# Altium schematic sheet Sheet1.SchDoc
size A3
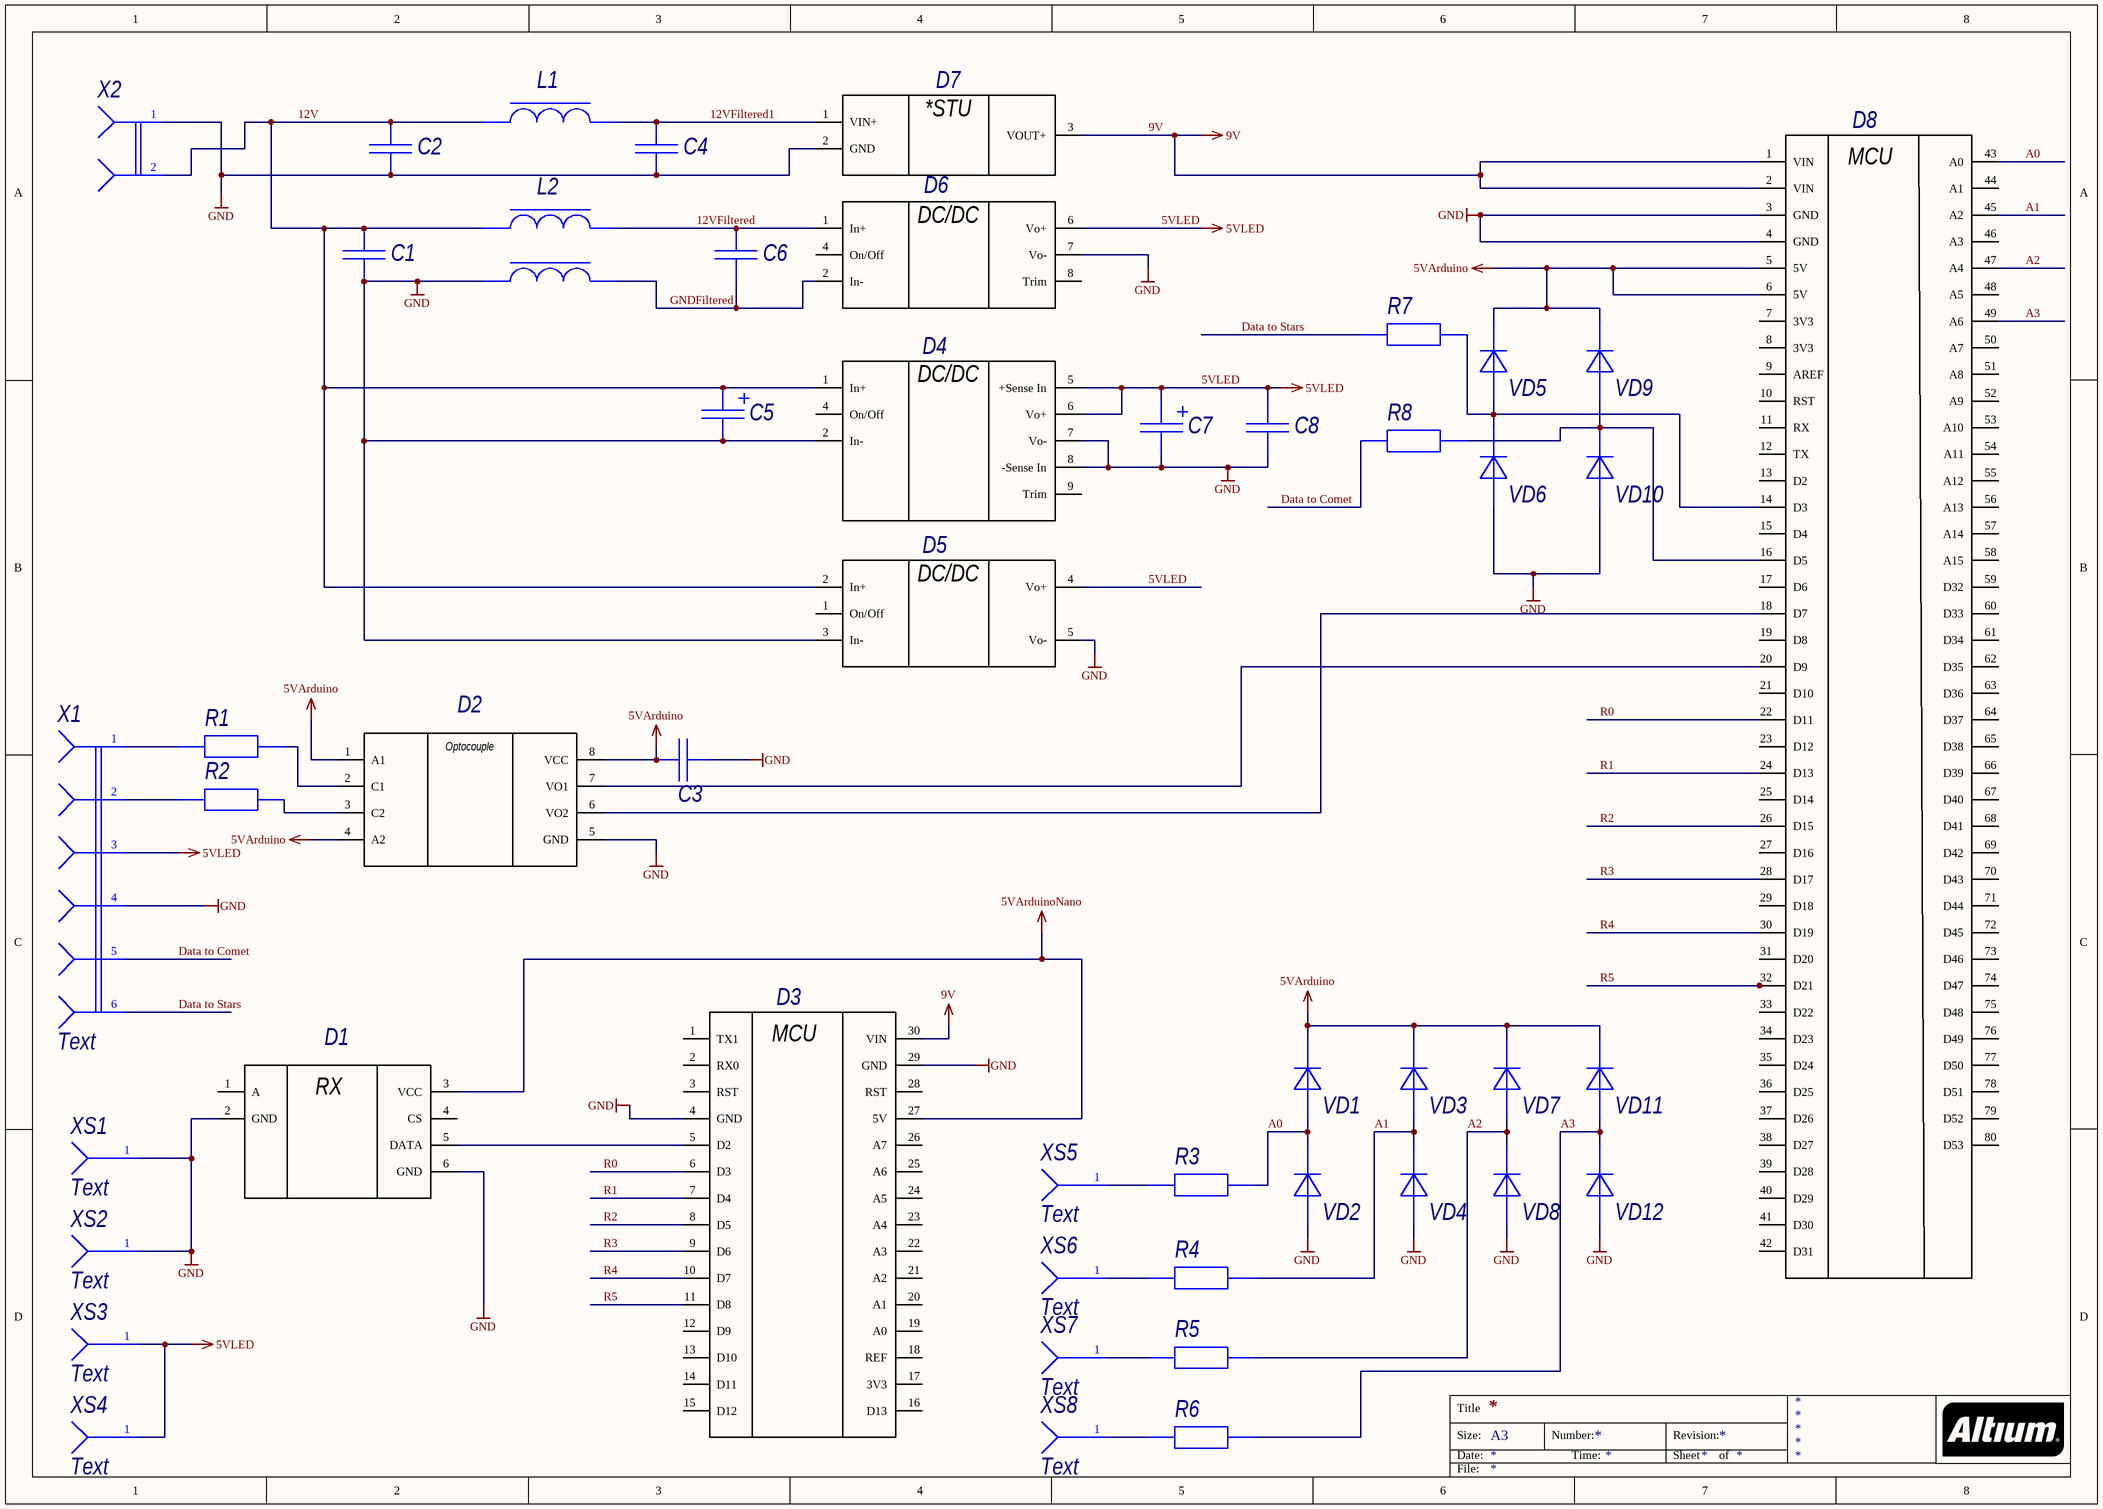
[diagram p0: Sheet1.SchDoc]

## Parts
C1  Capacitor  [0805CAP]  (value not drawn)
C2  Capacitor  [0805CAP]  (value not drawn)
C3  Capacitor  [0805CAP]  (value not drawn)
C4  Capacitor  [0805CAP]  (value not drawn)
C5  Capacitor-Polar  [AL_CAP_D6.3L7.7]  (value not drawn)
C6  Capacitor  [0805CAP]  (value not drawn)
C7  Capacitor-Polar  [AL_CAP_d4l5.4]  (value not drawn)
C8  Capacitor  [0805CAP]  (value not drawn)
D1  SRX882  [SRX882]  (value not drawn)
D2  HCPL-0631  [SOIC8]  (value not drawn)
D3  Arduino Nano  [ARDUINO_NANO]  (value not drawn)
D4  UEI-5-10-Q12PR-C  [UEI50 Case C74]  (value not drawn)
D5  МПА15  [МПА15]  (value not drawn)
D6  FDD25-05S1  [FDD25 50.8x50.8]  (value not drawn)
D7  R-78E9.0-0.5  [UL94V-0]  (value not drawn)
D8  Arduino Mega 2560 Pro  [ARDUINO MEGA2560 PRO]  (value not drawn)
L1  Coil  [1812]  (value not drawn)
L2  Common Mode Filter  [ACM7060]  (value not drawn)
R1  Resistor  [0805]  (value not drawn)
R2  Resistor  [0805]  (value not drawn)
R3  Resistor  [0805]  (value not drawn)
R4  Resistor  [0805]  (value not drawn)
R5  Resistor  [0805]  (value not drawn)
R6  Resistor  [0805]  (value not drawn)
R7  Resistor  [0805]  (value not drawn)
R8  Resistor  [0805]  (value not drawn)
VD1  Diode  [SOD80]  (value not drawn)
VD2  Diode  [SOD80]  (value not drawn)
VD3  Diode  [SOD80]  (value not drawn)
VD4  Diode  [SOD80]  (value not drawn)
VD5  Diode  [SOD80]  (value not drawn)
VD6  Diode  [SOD80]  (value not drawn)
VD7  Diode  [SOD80]  (value not drawn)
VD8  Diode  [SOD80]  (value not drawn)
VD9  Diode  [SOD80]  (value not drawn)
VD10  Diode  [SOD80]  (value not drawn)
VD11  Diode  [SOD80]  (value not drawn)
VD12  Diode  [SOD80]  (value not drawn)
X1  Text  [DG142r-5.08-06p - duplicate]
X2  (no value)  [DG142r-5.08-02p]
XS1  Text  [Through Hole 1 mm]
XS2  Text  [Through Hole 1 mm]
XS3  Text  [Through Hole 1 mm]
XS4  Text  [Through Hole 1 mm]
XS5  Text  [Through Hole 1 mm]
XS6  Text  [Through Hole 1 mm]
XS7  Text  [Through Hole 1 mm]
XS8  Text  [Through Hole 1 mm]

## Nets
5VArduino: C3.2 D2.1(A1) D2.4(A2) D2.8(VCC) D8.5(5V) D8.6(5V) VD1.2(К) VD3.2(К) VD5.2(К) VD7.2(К) VD9.2(К) VD11.2(К)
5VArduinoNano: D1.3(VCC) D3.27(5V)
5VLED: C7.1 C8.2 D4.5(+Sense_In) D4.6(Vo+) D5.4(Vo+) D6.6(Vo+) X1.3 XS3.1 XS4.1
9V: D3.30(VIN) D7.3(VOUT+) D8.1(VIN) D8.2(VIN)
GND: C1.1 C2.1 C3.1 C4.1 C5.2 C7.2 C8.1 D1.2(GND) D1.6(GND) D2.5(GND) D3.4(GND) D3.29(GND) D4.2(In-) D4.7(Vo-) D4.8(-Sense_In) D5.3(In-) D5.5(Vo-) D6.7(Vo-) D7.2(GND) D8.3(GND) D8.4(GND) L2.2 VD2.1(А) VD4.1(А) VD6.1(А) VD8.1(А) VD10.1(А) VD12.1(А) X1.4 X2.1 XS1.1 XS2.1
12V: C1.2 C2.2 C5.1 D4.1(In+) D5.2(In+) L1.1 L2.1 X2.2
12VFiltered: C6.2 D6.1(In+) L2.4
12VFiltered1: C4.2 D7.1(VIN+) L1.2
A0: D8.43(A0) R3.2 VD1.1(А) VD2.2(К)
A1: D8.45(A2) R4.2 VD3.1(А) VD4.2(К)
A2: D8.47(A4) R5.2 VD7.1(А) VD8.2(К)
A3: D8.49(A6) R6.2 VD11.1(А) VD12.2(К)
Data to Comet: R8.1 X1.5
Data to Stars: R7.1 X1.6
GNDFiltered: C6.1 D6.2(In-) L2.3
R0: D3.6(D3) D8.22(D11)
R1: D3.7(D4) D8.24(D13)
R2: D3.8(D5) D8.26(D15)
R3: D3.9(D6) D8.28(D17)
R4: D3.10(D7) D8.30(D19)
R5: D3.11(D8) D8.32(D21)
NetD1_5: D1.5(DATA) D3.5(D2)
NetD2_2: D2.2(C1) R1.2
NetD2_3: D2.3(C2) R2.2
NetD2_6: D2.6(VO2) D8.18(D7)
NetD2_7: D2.7(VO1) D8.20(D9)
NetD8_14: D8.14(D3) R7.2 VD5.1(А) VD6.2(К)
NetD8_16: D8.16(D5) R8.2 VD9.1(А) VD10.2(К)
NetR1_1: R1.1 X1.1
NetR2_1: R2.1 X1.2
NetR3_1: R3.1 XS5.1
NetR4_1: R4.1 XS6.1
NetR5_1: R5.1 XS7.1
NetR6_1: R6.1 XS8.1

Not connected (* = marked no-connect by the designer): D1 1(A) 4(CS); D3 1(TX1) 2(RX0) 3(RST) 12(D9) 13(D10) 14(D11) 15(D12) 16(D13) 17(3V3) 18(REF) 19(A0) 20(A1) 21(A2) 22(A3) 23(A4) 24(A5) 25(A6) 26(A7) 28(RST); D4 4(On/Off) 9(Trim); D5 1(On/Off); D6 4(On/Off) 8(Trim); D8 7(3V3) 8(3V3) 9(AREF) 10(RST) 11(RX) 12(TX) 13(D2) 15(D4) 17(D6) 19(D8) 21(D10) 23(D12) 25(D14) 27(D16) 29(D18) 31(D20) 33(D22) 34(D23) 35(D24) 36(D25) 37(D26) 38(D27) 39(D28) 40(D29) 41(D30) 42(D31) 44(A1) 46(A3) 48(A5) 50(A7) 51(A8) 52(A9) 53(A10) 54(A11) 55(A12) 56(A13) 57(A14) 58(A15) 59(D32) 60(D33) 61(D34) 62(D35) 63(D36) 64(D37) 65(D38) 66(D39) 67(D40) 68(D41) 69(D42) 70(D43) 71(D44) 72(D45) 73(D46) 74(D47) 75(D48) 76(D49) 77(D50) 78(D51) 79(D52) 80(D53)

## Notes on the sheet
- Title
- Size:
- Date:
- A3
- Number:
- Time:
- Revision:
- Sheet
- of
- File:
- (in symbol Arduino Mega 2560 Pro) MCU
- (in symbol Arduino Nano) MCU
- (in symbol FDD25-05S1) DC/DC
- (in symbol HCPL-0631) Optocouple
- (in symbol R-78E9.0-0.5) *STU
- (in symbol SRX882) RX
- (in symbol UEI-5-10-Q12PR-C) DC/DC
- (in symbol МПА15) DC/DC

## Library data of the parts
C1-C4 C6 C8 = Capacitor: Type: Конденсатор; Published: 18.05.2010; Publisher: Andrew Danich
C5 C7 = Capacitor-Polar: Type: Конденсатор; Published: 20.08.2010; Publisher: Andrew Danich
D1 = SRX882: Type: Модуль; Published: 29.07.2015; Publisher: Andrew Danich
D2 = HCPL-0631: Type: Модуль; Published: 29.07.2015; Publisher: Andrew Danich
D3 = Arduino Nano: Type: Модуль; Published: 29.07.2015; Publisher: Andrew Danich
D4 = UEI-5-10-Q12PR-C: Type: Модуль; Published: 29.07.2015; Publisher: Andrew Danich
D5 = МПА15: Type: Модуль; Published: 29.07.2015; Publisher: Andrew Danich
D6 = FDD25-05S1: Type: Модуль; Published: 29.07.2015; Publisher: Andrew Danich
D7 = R-78E9.0-0.5: Type: Модуль; Published: 29.07.2015; Publisher: Andrew Danich
D8 = Arduino Mega 2560 Pro: Type: Модуль; Published: 29.07.2015; Publisher: Andrew Danich
L1 = Coil: Type: Дроссель; Published: 20.05.2010; Publisher: Andrew Danich
L2 = Common Mode Filter: Type: Дроссель; Published: 20.05.2010; Publisher: Andrew Danich
VD1-VD12 = Diode: Type: Диод; Published: 18.05.2010; Publisher: Andrew Danich
X1 = Con-6-F: Value: Connector; Published: 07.03.2013; Publisher: Andrew Danich; Type: Розетка
X2 = Con-2-F: Value: Connector; Published: 07.03.2013; Publisher: Andrew Danich; Type: Розетка
XS1-XS8 = Con-1-F: Published: 07.03.2013; Publisher: Andrew Danich; Type: Розетка
R1-R8 = Resistor: Published: 24.03.2010; Publisher: Andrew Danich; Type: Резистор